# Altium schematic sheet MOTOR_DRIVER.SchDoc
size B
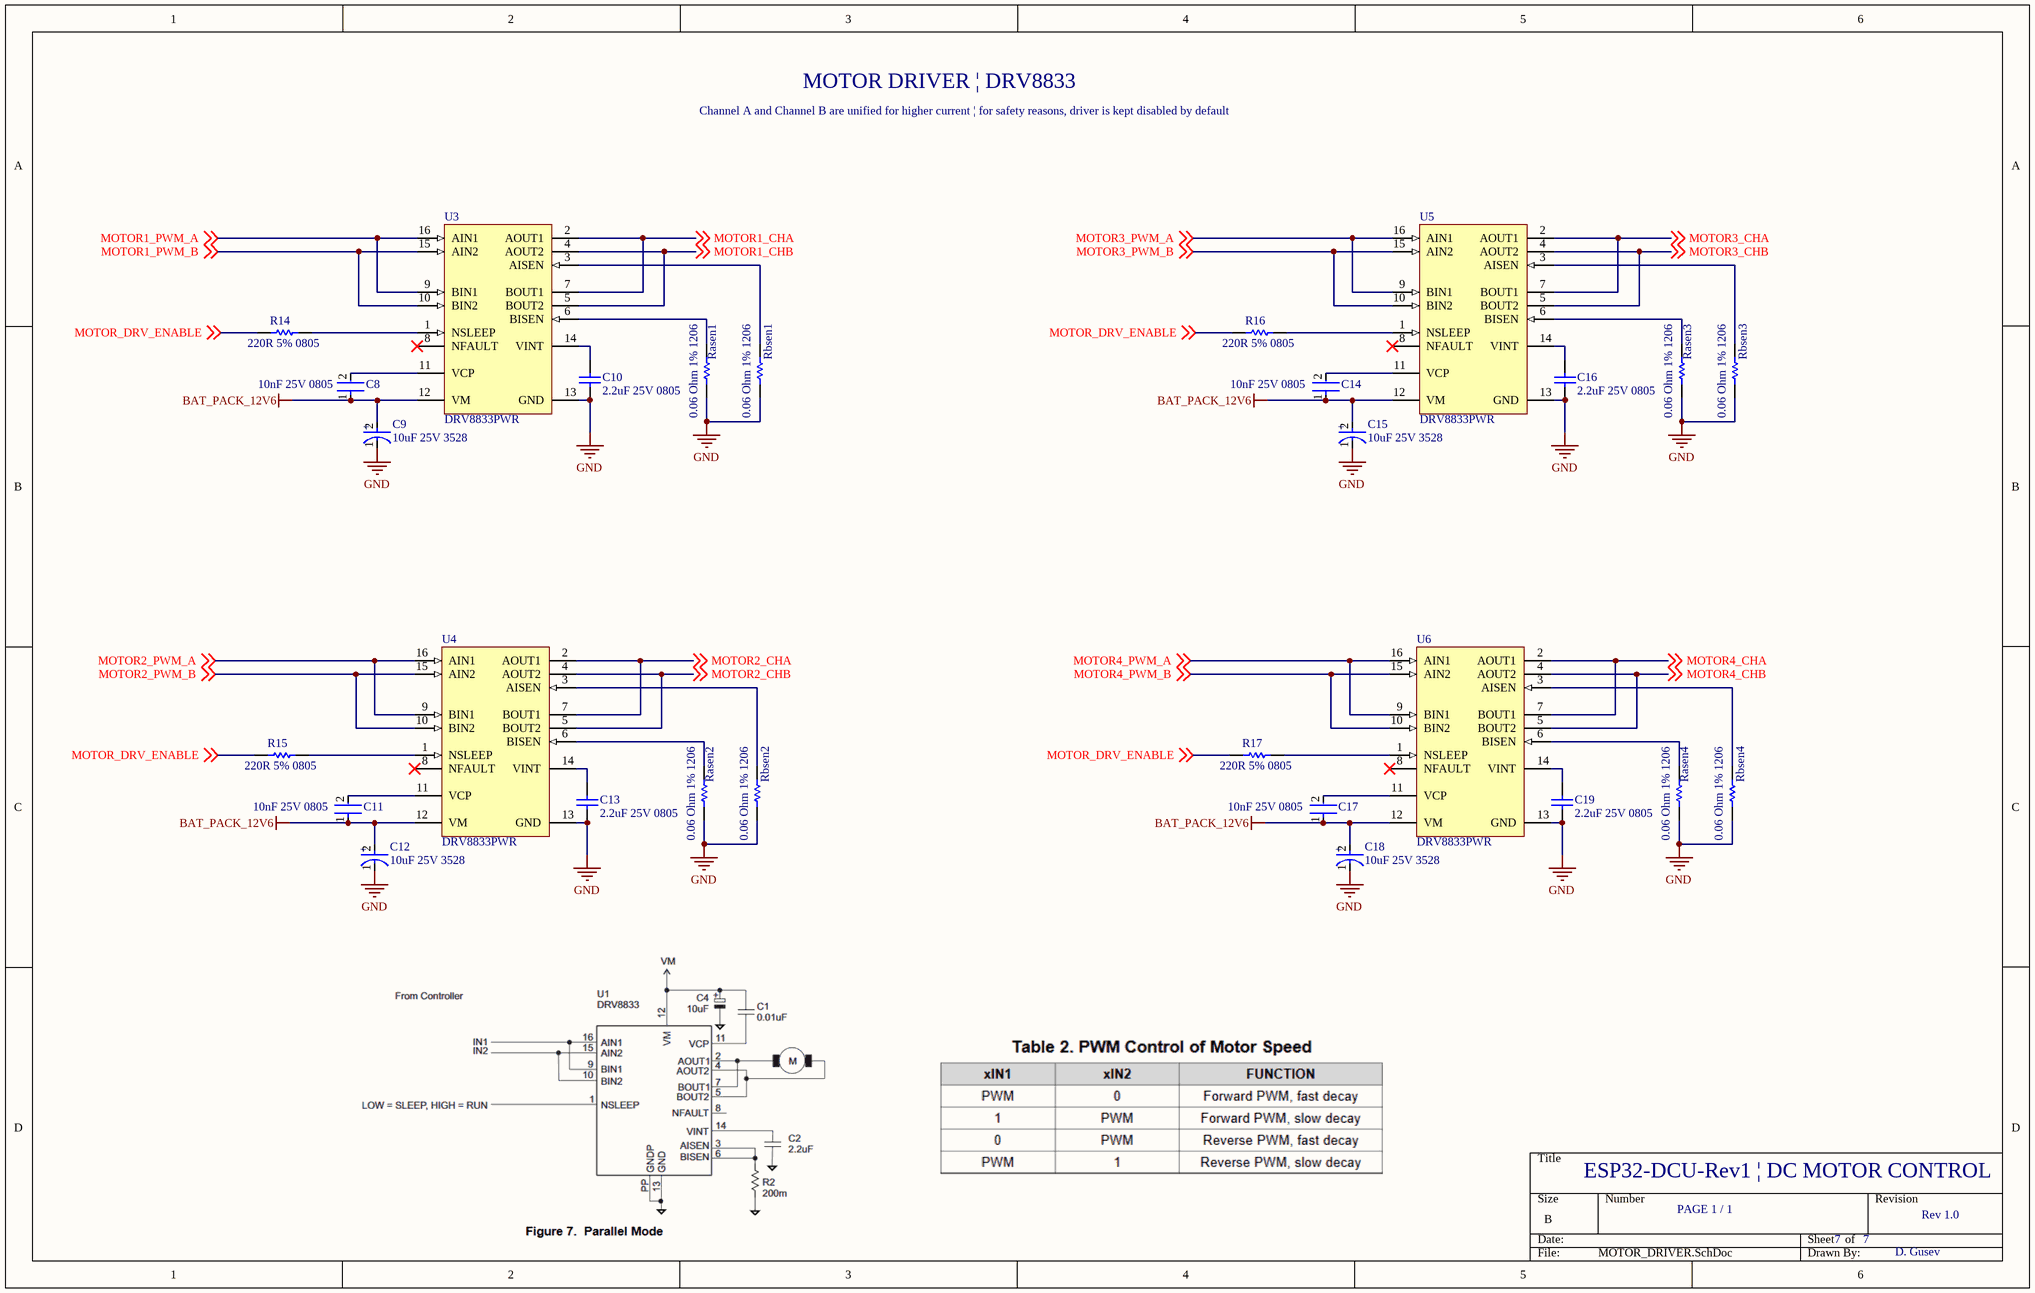
[diagram p0: MOTOR_DRIVER.SchDoc]

## Parts
C8  10nF 25V 0805  [FP-C0805C-DN-MFG]
C9  10uF 25V 3528  [FP-T491B106K025AT-MFG]
C10  2.2uF 25V 0805  [CAPC2013X135X45ML10T25]
C11  10nF 25V 0805  [FP-C0805C-DN-MFG]
C12  10uF 25V 3528  [FP-T491B106K025AT-MFG]
C13  2.2uF 25V 0805  [CAPC2013X135X45ML10T25]
C14  10nF 25V 0805  [FP-C0805C-DN-MFG]
C15  10uF 25V 3528  [FP-T491B106K025AT-MFG]
C16  2.2uF 25V 0805  [CAPC2013X135X45ML10T25]
C17  10nF 25V 0805  [FP-C0805C-DN-MFG]
C18  10uF 25V 3528  [FP-T491B106K025AT-MFG]
C19  2.2uF 25V 0805  [CAPC2013X135X45ML10T25]
R14  220R 5% 0805  [RESC2013X60X40NL20T25]
R15  220R 5% 0805  [RESC2013X60X40NL20T25]
R16  220R 5% 0805  [RESC2013X60X40NL20T25]
R17  220R 5% 0805  [RESC2013X60X40NL20T25]
Rasen1  0.06 Ohm 1% 1206  [RESC3216X89X51NL25T25]
Rasen2  0.06 Ohm 1% 1206  [RESC3216X89X51NL25T25]
Rasen3  0.06 Ohm 1% 1206  [RESC3216X89X51NL25T25]
Rasen4  0.06 Ohm 1% 1206  [RESC3216X89X51NL25T25]
Rbsen1  0.06 Ohm 1% 1206  [RESC3216X89X51NL25T25]
Rbsen2  0.06 Ohm 1% 1206  [RESC3216X89X51NL25T25]
Rbsen3  0.06 Ohm 1% 1206  [RESC3216X89X51NL25T25]
Rbsen4  0.06 Ohm 1% 1206  [RESC3216X89X51NL25T25]
U3  DRV8833PWR  [PW0016A_L]
U4  DRV8833PWR  [PW0016A_L]
U5  DRV8833PWR  [PW0016A_L]
U6  DRV8833PWR  [PW0016A_L]

## Nets
BAT_PACK_12V6: C8.1 C9.2(A) C11.1 C12.2(A) C14.1 C15.2(A) C17.1 C18.2(A) U3.12(VM) U4.12(VM) U5.12(VM) U6.12(VM)
GND: C9.1(C) C10.1 C12.1(C) C13.1 C15.1(C) C16.1 C18.1(C) C19.1 Rasen1.1 Rasen2.1 Rasen3.1 Rasen4.1 Rbsen1.1 Rbsen2.1 Rbsen3.1 Rbsen4.1 U3.13(GND) U4.13(GND) U5.13(GND) U6.13(GND)
MOTOR1_CHA: U3.2(AOUT1) U3.7(BOUT1) ; off-sheet MOTOR1_CHA
MOTOR1_CHB: U3.4(AOUT2) U3.5(BOUT2) ; off-sheet MOTOR1_CHB
MOTOR1_PWM_A: U3.9(BIN1) U3.16(AIN1) ; off-sheet MOTOR1_PWM_A
MOTOR1_PWM_B: U3.10(BIN2) U3.15(AIN2) ; off-sheet MOTOR1_PWM_B
MOTOR2_CHA: U4.2(AOUT1) U4.7(BOUT1) ; off-sheet MOTOR2_CHA
MOTOR2_CHB: U4.4(AOUT2) U4.5(BOUT2) ; off-sheet MOTOR2_CHB
MOTOR2_PWM_A: U4.9(BIN1) U4.16(AIN1) ; off-sheet MOTOR2_PWM_A
MOTOR2_PWM_B: U4.10(BIN2) U4.15(AIN2) ; off-sheet MOTOR2_PWM_B
MOTOR3_CHA: U5.2(AOUT1) U5.7(BOUT1) ; off-sheet MOTOR3_CHA
MOTOR3_CHB: U5.4(AOUT2) U5.5(BOUT2) ; off-sheet MOTOR3_CHB
MOTOR3_PWM_A: U5.9(BIN1) U5.16(AIN1) ; off-sheet MOTOR3_PWM_A
MOTOR3_PWM_B: U5.10(BIN2) U5.15(AIN2) ; off-sheet MOTOR3_PWM_B
MOTOR4_CHA: U6.2(AOUT1) U6.7(BOUT1) ; off-sheet MOTOR4_CHA
MOTOR4_CHB: U6.4(AOUT2) U6.5(BOUT2) ; off-sheet MOTOR4_CHB
MOTOR4_PWM_A: U6.9(BIN1) U6.16(AIN1) ; off-sheet MOTOR4_PWM_A
MOTOR4_PWM_B: U6.10(BIN2) U6.15(AIN2) ; off-sheet MOTOR4_PWM_B
MOTOR_DRV_ENABLE: R14.1 R15.1 R16.1 R17.1 ; off-sheet MOTOR_DRV_ENABLE
NetC8_2: C8.2 U3.11(VCP)
NetC10_2: C10.2 U3.14(VINT)
NetC11_2: C11.2 U4.11(VCP)
NetC13_2: C13.2 U4.14(VINT)
NetC14_2: C14.2 U5.11(VCP)
NetC16_2: C16.2 U5.14(VINT)
NetC17_2: C17.2 U6.11(VCP)
NetC19_2: C19.2 U6.14(VINT)
NetR14_2: R14.2 U3.1(NSLEEP)
NetR15_2: R15.2 U4.1(NSLEEP)
NetR16_2: R16.2 U5.1(NSLEEP)
NetR17_2: R17.2 U6.1(NSLEEP)
NetRasen1_2: Rasen1.2 U3.6(BISEN)
NetRasen2_2: Rasen2.2 U4.6(BISEN)
NetRasen3_2: Rasen3.2 U5.6(BISEN)
NetRasen4_2: Rasen4.2 U6.6(BISEN)
NetRbsen1_2: Rbsen1.2 U3.3(AISEN)
NetRbsen2_2: Rbsen2.2 U4.3(AISEN)
NetRbsen3_2: Rbsen3.2 U5.3(AISEN)
NetRbsen4_2: Rbsen4.2 U6.3(AISEN)

Not connected (* = marked no-connect by the designer): U3 8(NFAULT)*; U4 8(NFAULT)*; U5 8(NFAULT)*; U6 8(NFAULT)*

## Notes on the sheet
- MOTOR DRIVER | DRV8833
- Channel A and Channel B are unified for higher current | for safety reasons, driver is kept disabled by default
- ESP32-DCU-Rev1 | DC MOTOR CONTROL
- PAGE 1 / 1
- 7
- Rev 1.0
- D. Gusev
- (in symbol CMP-03017-000036-1) +

## Library data of the parts
C8 C11 C14 C17 = CMP-2007-00493-2: CAP CER 10000PF 25V 5% NP0 0805; Manufacturer: KEMET; Manufacturer Part Number: C0805C103J3GACTU; Capacitance: 10,000 pF; Tolerance: 0.05; Value: 10,000 pF; Material: Ceramic; Temperature Characteristic: C0G; Temperature Coefficient: 30ppm/°C; Octopart: https://octopart.com/c0805c103j3gactu-kemet-12563663; Lead Free: Yes; RoHS: TRUE; Package: C0805C-DN; Voltage Rating: 25 V; Ipc Land Pattern Name: CAPC200125X78; ComponentLink2URL: https://content.kemet.com/datasheets/KEM_C1003_C0G_SMD.pdf; Device Class L1: Passive Components; Category: Cap; ComponentLink2Description: Datasheet; Temperature Range High: +125°C; Height: 0.88mm; Temperature Range Low: -55°C; Device Class L3: Ceramic Capacitors; Digikey Description: CAP CER 10000PF 25V 5% NP0 0805; Device Class L2: Capacitors; Mouser Description: Multilayer Ceramic Capacitors MLCC - SMD/SMT 25volts 10000pF 5% C0G; Temperature: -55°C to +125°C; Automotive: No
C9 C12 C15 C18 = CMP-03017-000036-1: CAP TANT 10UF 10% 25V 1411; Life (Hours): 2000Hour; Leakage Current: 2.5uA; ESR (Equivalent Series Resistance): 3R; Ripple Current: 168mA; Polarity: Polar; Dielectric Material: Tantalum; Dissipation Factor: 8%; Package Quantity: 1; Series: T491; Features: General Purpose; Lead Free: Lead Free; Termination: SMD/SMT; Packaging: Tape and Reel; Max Operating Temperature: 125°C; Number of Pins: 2; Case Code (Imperial): 1411; Height - Seated (Max): 0.083inch; Min Operating Temperature: -55°C; Case/Package: 1411; Voltage: 25V; Tolerance: 10%; REACH SVHC: No SVHC; Case Code (Metric): 3528; Depth: 2.8mm; Mount: Surface Mount; Voltage Rating (DC): 25V; Length: 3.5mm; Voltage Rating: 25V; Capacitance: 10uF; Construction: Flat; RoHS Compliant: Yes; Height: 1.9mm; Width: 0.11inch; Radiation Hardening: No
C10 C13 C16 C19 = CMP-2007-03522-1: Part Number: GRM21BF51E225ZA01L; Manufacturer: Murata
R14-R17 = CMP-2001-00612-1: Manufacturer: Panasonic; Part Number: ERA6AEB221V
Rasen1-Rasen4 Rbsen1-Rbsen4 = CMP-2003-04364-1: Manufacturer: Vishay Dale; Part Number: WSL1206R0600FEA
U3-U6 = CMP-1529-00001-2: 2 A Low Voltage Dual Brushed DC or Single Bipolar Stepper Motor Driver (PWM Ctrl), 2.7 to 10.8 V, -40 to 85 degC, 16-Pin SOP (PW), Green (RoHS & no Sb/Br), Tape and Reel; Manufacturer: Texas Instruments; Vs: 2.7 V Min.; Peak Output Current: 2 A; rDS (ON) (LS + HS): 360 mOhms; RMS Output Current: 1.5 A; DatasheetVersion: SLVSAR1D; Mounting Technology: Surface Mount; ComponentLink2URL: http://www.ti.com/lit/ds/symlink/drv8833.pdf; Packing: Tape and Reel; Temperature Range: -40 to 85 degC; Eco-Plan: Green (RoHS & no Sb/Br); Package Reference: PW0016A; PackageDescription: 16-Pin Plastic Small Outline, Body 4.4 x 5 mm, Pitch 0.65 mm; ComponentLink1URL: www.ti.com; ComponentLink2Description: Datasheet; ComponentLink3Description: Package Specification; Control I/F: PWM; PackageVersion: 4040064-4/G; ComponentLink3URL: http://www.ti.com/lit/ml/mpds361/mpds361.pdf; PartNumber: DRV8833PWR; ComponentLink1Description: Manufacturer URL